# Altium schematic sheet SoC_Peripheral.SchDoc
size A4; SheetNumber: 21; SheetTotal: 22
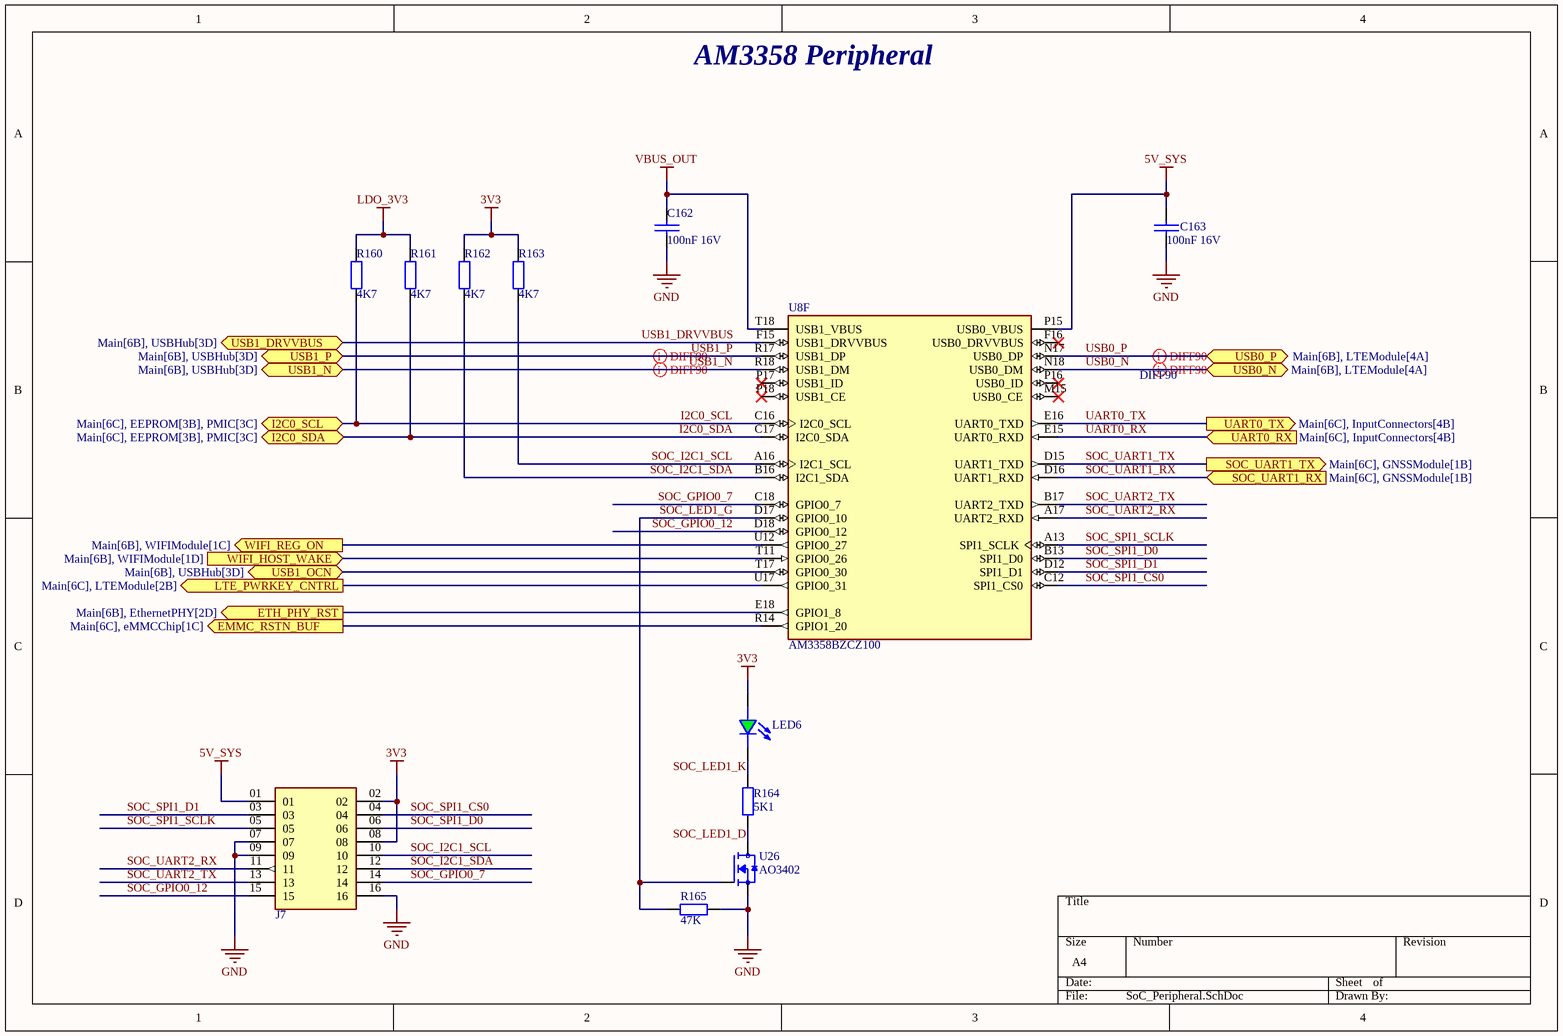
[diagram p0: SoC_Peripheral.SchDoc]

## Parts
C162  100nF 16V  [C_0402]
C163  100nF 16V  [C_0402]
J7  header_2.54_16pin_2row  [header_2.54_16pin_2row]  (value not drawn)
LED6  LED_0603_GREEN  [LED_0603]  (value not drawn)
R160  4K7  [R_0402]
R161  4K7  [R_0402]
R162  4K7  [R_0402]
R163  4K7  [R_0402]
R164  5K1  [R_0603]
R165  47K  [R_0603]
U8  AM3358BZCZ100  [BGA324C80P18X18_1500X1500X140]  (part F of 9)
U26  AO3402  [SOT-23-3]

## Ports
EMMC_RSTN_BUF (out, see Main[6C], eMMCChip[1C]), ETH_PHY_RST (out, see Main[6B], EthernetPHY[2D]), I2C0_SCL (bidir, see Main[6C], EEPROM[3B], PMIC[3C]), I2C0_SDA (bidir, see Main[6C], EEPROM[3B], PMIC[3C]), LTE_PWRKEY_CNTRL (out, see Main[6C], LTEModule[2B]), SOC_UART1_RX (in, see Main[6C], GNSSModule[1B]), SOC_UART1_TX (out, see Main[6C], GNSSModule[1B]), UART0_RX (in, see Main[6C], InputConnectors[4B]), UART0_TX (out, see Main[6C], InputConnectors[4B]), USB0_N (bidir, see Main[6B], LTEModule[4A]), USB0_P (bidir, see Main[6B], LTEModule[4A]), USB1_DRVVBUS (bidir, see Main[6B], USBHub[3D]), USB1_N (bidir, see Main[6B], USBHub[3D]), USB1_OCN (bidir, see Main[6B], USBHub[3D]), USB1_P (bidir, see Main[6B], USBHub[3D]), WIFI_HOST_WAKE (in, see Main[6B], WIFIModule[1D]), WIFI_REG_ON (out, see Main[6B], WIFIModule[1C])

## Nets
3V3: J7.02 J7.08 LED6.1(A) R162.2 R163.2
5V_SYS: C163.1 J7.01 U8.P15(USB0_VBUS)
GND: C162.2 C163.2 J7.07 J7.09 J7.16 R165.2 U26.2(S)
LDO_3V3: R160.2 R161.2
VBUS_OUT: C162.1 U8.T18(USB1_VBUS)
EMMC_RSTN_BUF: U8.R14(GPIO1_20) ; port EMMC_RSTN_BUF
ETH_PHY_RST: U8.E18(GPIO1_8) ; port ETH_PHY_RST
I2C0_SCL: R160.1 U8.C16(I2C0_SCL) ; port I2C0_SCL
I2C0_SDA: R161.1 U8.C17(I2C0_SDA) ; port I2C0_SDA
LTE_PWRKEY_CNTRL: U8.U17(GPIO0_31) ; port LTE_PWRKEY_CNTRL
SOC_GPIO0_7: J7.14 U8.C18(GPIO0_7)
SOC_GPIO0_12: J7.15 U8.D18(GPIO0_12)
SOC_I2C1_SCL: J7.10 R163.1 U8.A16(I2C1_SCL)
SOC_I2C1_SDA: J7.12 R162.1 U8.B16(I2C1_SDA)
SOC_LED1_D: R164.1 U26.3(D)
SOC_LED1_G: R165.1 U8.D17(GPIO0_10) U26.1(G)
SOC_LED1_K: LED6.2(C) R164.2
SOC_SPI1_CS0: J7.04 U8.C12(SPI1_CS0)
SOC_SPI1_D0: J7.06 U8.B13(SPI1_D0)
SOC_SPI1_D1: J7.03 U8.D12(SPI1_D1)
SOC_SPI1_SCLK: J7.05 U8.A13(SPI1_SCLK)
SOC_UART1_RX: U8.D16(UART1_RXD) ; port SOC_UART1_RX
SOC_UART1_TX: U8.D15(UART1_TXD) ; port SOC_UART1_TX
SOC_UART2_RX: J7.11 U8.A17(UART2_RXD)
SOC_UART2_TX: J7.13 U8.B17(UART2_TXD)
UART0_RX: U8.E15(UART0_RXD) ; port UART0_RX
UART0_TX: U8.E16(UART0_TXD) ; port UART0_TX
USB0_N: U8.N18(USB0_DM) ; port USB0_N
USB0_P: U8.N17(USB0_DP) ; port USB0_P
USB1_DRVVBUS: U8.F15(USB1_DRVVBUS) ; port USB1_DRVVBUS
USB1_N: U8.R18(USB1_DM) ; port USB1_N
USB1_OCN: U8.T17(GPIO0_30) ; port USB1_OCN
USB1_P: U8.R17(USB1_DP) ; port USB1_P
WIFI_HOST_WAKE: U8.T11(GPIO0_26) ; port WIFI_HOST_WAKE
WIFI_REG_ON: U8.U12(GPIO0_27) ; port WIFI_REG_ON

Not connected (* = marked no-connect by the designer): U8 F16(USB0_DRVVBUS)* M15(USB0_CE)* P16(USB0_ID)* P17(USB1_ID)* P18(USB1_CE)*

## Layout directives
differential pair; differential pair class DIFF90: USB0_N, USB0_P, USB1_N, USB1_P

## Notes on the sheet
- AM3358 Peripheral

## Library data of the parts
C162 C163 = C_0402: Capacitor 0402 SMD
R160-R163 = R_0402: Resistor 0402 SMD
R164 R165 = R_0603: Resistor 0603 SMD
U8 = AM3358BZCZ100: ARM-ASeries 1GHz NFBGA-324 Microcontrollers (MCU/MPU/SOC) ROHS; Manufacturer: Texas Instruments; Manufacturer Part Number: AM3358BZCZ100; Datasheet Link: https://www.ti.com/lit/ds/symlink/am3358.pdf
U26 = AO3402: N-Channel 30 V 4A (Ta) 1.4W (Ta) Surface Mount SOT-23-3; Manufacturer: Alpha & Omega Semicon; Manufacturer Part Number: AO3402; ComponentLink1Description: Datasheet Link; ComponentLink1URL: https://www.lcsc.com/datasheet/lcsc_datasheet_2410121835_Alpha---Omega-Semicon-AO3402_C14385.pdf